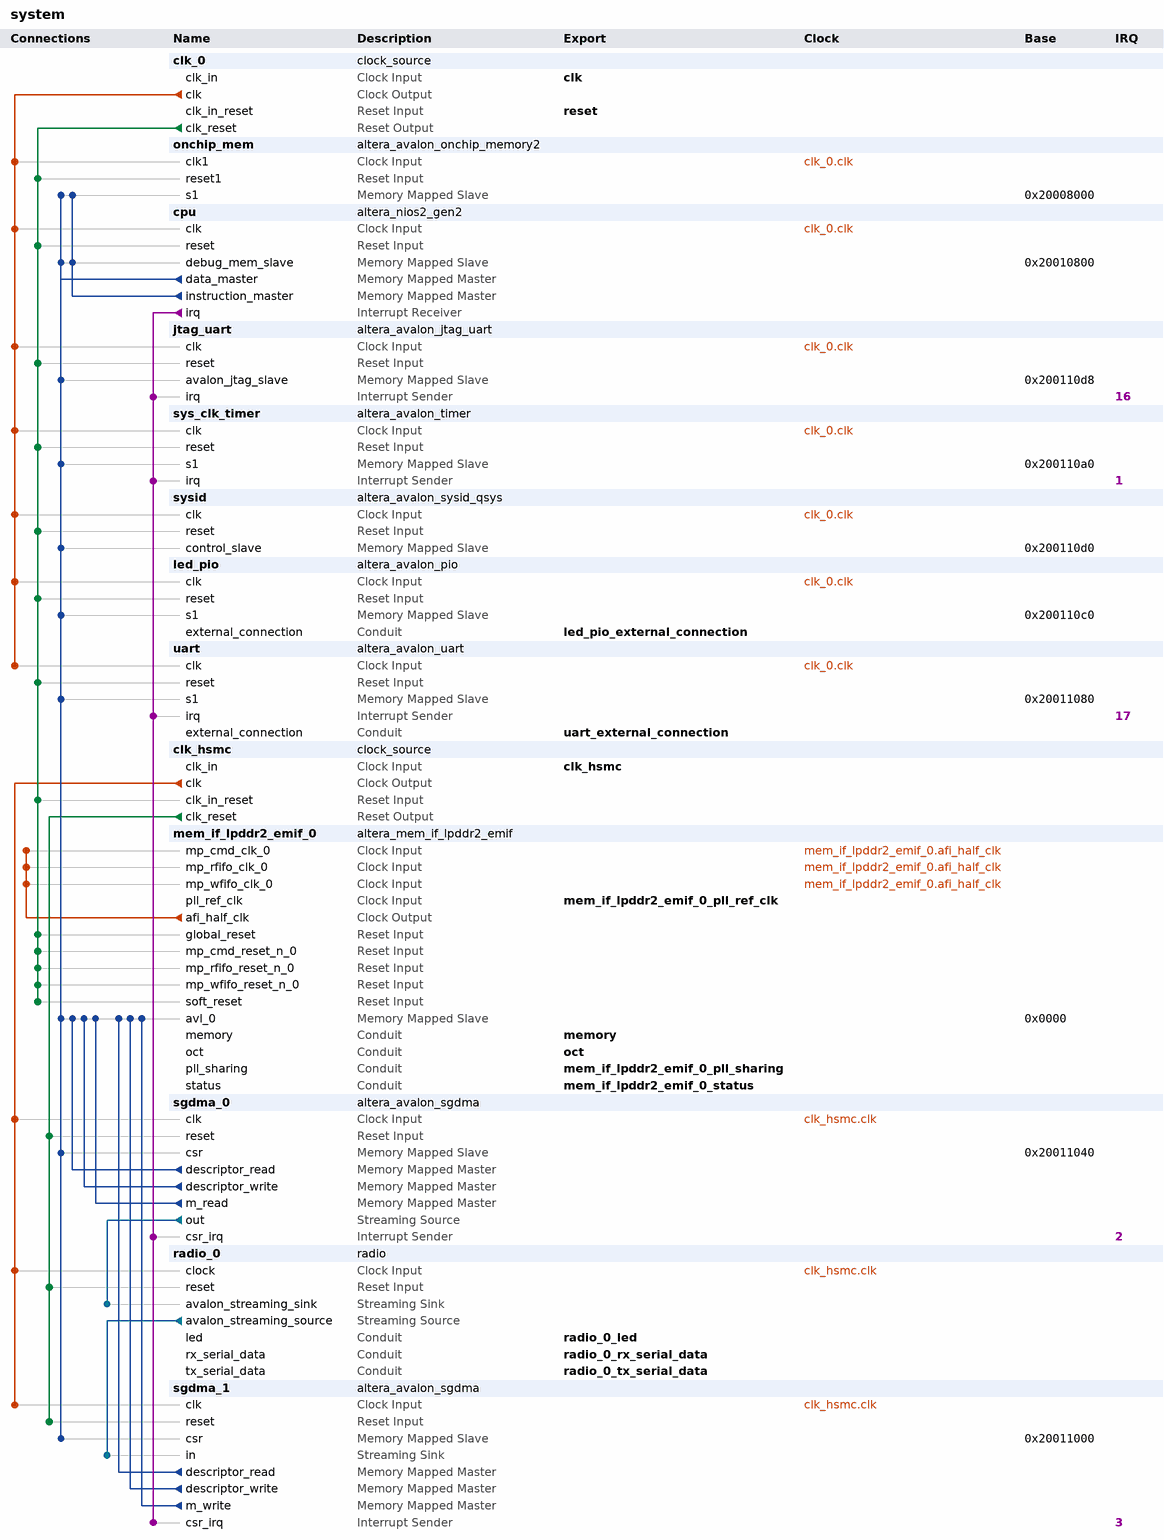
[diagram p0: system contents]
# Platform Designer (Qsys) system system, Cyclone V 5CGXFC5C6F27C7
# Parameters at their usual value, and those the tool derives, are not listed.
package require -exact qsys 15.1
create_system system
set_project_property DEVICE_FAMILY {Cyclone V}
set_project_property DEVICE 5CGXFC5C6F27C7

add_instance clk_0 clock_source 15.1
set_instance_parameter_value clk_0 clockFrequency 50000000

add_instance onchip_mem altera_avalon_onchip_memory2 15.1
set_instance_parameter_value onchip_mem dataWidth 32
set_instance_parameter_value onchip_mem dualPort false
set_instance_parameter_value onchip_mem initMemContent true
set_instance_parameter_value onchip_mem initializationFileName onchip_mem.hex
set_instance_parameter_value onchip_mem memorySize 32768

add_instance cpu altera_nios2_gen2 15.1
set_instance_parameter_value cpu dcache_size 0
set_instance_parameter_value cpu exceptionSlave onchip_mem.s1
set_instance_parameter_value cpu icache_size 2048
set_instance_parameter_value cpu impl Fast
set_instance_parameter_value cpu resetSlave onchip_mem.s1
set_instance_parameter_value cpu setting_branchpredictiontype Static

add_instance jtag_uart altera_avalon_jtag_uart 15.1
set_instance_parameter_value jtag_uart simInteractiveOptions NO_INTERACTIVE_WINDOWS

add_instance sys_clk_timer altera_avalon_timer 15.1
set_instance_parameter_value sys_clk_timer period 1
set_instance_parameter_value sys_clk_timer periodUnits MSEC

add_instance sysid altera_avalon_sysid_qsys 15.1
set_instance_parameter_value sysid id 0

add_instance led_pio altera_avalon_pio 15.1
set_instance_parameter_value led_pio direction Output
set_instance_parameter_value led_pio width 8

add_instance uart altera_avalon_uart 15.1
set_instance_parameter_value uart baud 115200
set_instance_parameter_value uart dataBits 8
set_instance_parameter_value uart fixedBaud true
set_instance_parameter_value uart parity NONE
set_instance_parameter_value uart stopBits 1

add_instance clk_hsmc clock_source 15.1
set_instance_parameter_value clk_hsmc clockFrequency 125000000

add_instance mem_if_lpddr2_emif_0 altera_mem_if_lpddr2_emif 15.1
set_instance_parameter_value mem_if_lpddr2_emif_0 ABSTRACT_REAL_COMPARE_TEST false
set_instance_parameter_value mem_if_lpddr2_emif_0 ABS_RAM_MEM_INIT_FILENAME meminit
set_instance_parameter_value mem_if_lpddr2_emif_0 ACV_PHY_CLK_ADD_FR_PHASE 0.0
set_instance_parameter_value mem_if_lpddr2_emif_0 AC_PACKAGE_DESKEW false
set_instance_parameter_value mem_if_lpddr2_emif_0 AC_ROM_USER_ADD_0 0_0000_0000_0000
set_instance_parameter_value mem_if_lpddr2_emif_0 AC_ROM_USER_ADD_1 0_0000_0000_1000
set_instance_parameter_value mem_if_lpddr2_emif_0 ADDR_ORDER 0
set_instance_parameter_value mem_if_lpddr2_emif_0 ADD_EFFICIENCY_MONITOR false
set_instance_parameter_value mem_if_lpddr2_emif_0 ADD_EXTERNAL_SEQ_DEBUG_NIOS false
set_instance_parameter_value mem_if_lpddr2_emif_0 ADVANCED_CK_PHASES false
set_instance_parameter_value mem_if_lpddr2_emif_0 ADVERTIZE_SEQUENCER_SW_BUILD_FILES false
set_instance_parameter_value mem_if_lpddr2_emif_0 AFI_DEBUG_INFO_WIDTH 32
set_instance_parameter_value mem_if_lpddr2_emif_0 ALTMEMPHY_COMPATIBLE_MODE false
set_instance_parameter_value mem_if_lpddr2_emif_0 AP_MODE false
set_instance_parameter_value mem_if_lpddr2_emif_0 AP_MODE_EN 0
set_instance_parameter_value mem_if_lpddr2_emif_0 AVL_DATA_WIDTH_PORT 32,32,32,32,32,32
set_instance_parameter_value mem_if_lpddr2_emif_0 AVL_MAX_SIZE 4
set_instance_parameter_value mem_if_lpddr2_emif_0 BYTE_ENABLE true
set_instance_parameter_value mem_if_lpddr2_emif_0 C2P_WRITE_CLOCK_ADD_PHASE 0.0
set_instance_parameter_value mem_if_lpddr2_emif_0 CALIBRATION_MODE Skip
set_instance_parameter_value mem_if_lpddr2_emif_0 CALIB_REG_WIDTH 8
set_instance_parameter_value mem_if_lpddr2_emif_0 CFG_DATA_REORDERING_TYPE INTER_BANK
set_instance_parameter_value mem_if_lpddr2_emif_0 CFG_REORDER_DATA true
set_instance_parameter_value mem_if_lpddr2_emif_0 CFG_TCCD_NS 2.5
set_instance_parameter_value mem_if_lpddr2_emif_0 COMMAND_PHASE 0.0
set_instance_parameter_value mem_if_lpddr2_emif_0 CONTROLLER_LATENCY 5
set_instance_parameter_value mem_if_lpddr2_emif_0 CORE_DEBUG_CONNECTION EXPORT
set_instance_parameter_value mem_if_lpddr2_emif_0 CPORT_TYPE_PORT Bidirectional,Bidirectional,Bidirectional,Bidirectional,Bidirectional,Bidirectional
set_instance_parameter_value mem_if_lpddr2_emif_0 CTL_AUTOPCH_EN false
set_instance_parameter_value mem_if_lpddr2_emif_0 CTL_CMD_QUEUE_DEPTH 8
set_instance_parameter_value mem_if_lpddr2_emif_0 CTL_CSR_CONNECTION INTERNAL_JTAG
set_instance_parameter_value mem_if_lpddr2_emif_0 CTL_CSR_ENABLED false
set_instance_parameter_value mem_if_lpddr2_emif_0 CTL_CSR_READ_ONLY 1
set_instance_parameter_value mem_if_lpddr2_emif_0 CTL_DEEP_POWERDN_EN false
set_instance_parameter_value mem_if_lpddr2_emif_0 CTL_DYNAMIC_BANK_ALLOCATION false
set_instance_parameter_value mem_if_lpddr2_emif_0 CTL_DYNAMIC_BANK_NUM 4
set_instance_parameter_value mem_if_lpddr2_emif_0 CTL_ECC_AUTO_CORRECTION_ENABLED false
set_instance_parameter_value mem_if_lpddr2_emif_0 CTL_ECC_ENABLED false
set_instance_parameter_value mem_if_lpddr2_emif_0 CTL_ENABLE_BURST_INTERRUPT false
set_instance_parameter_value mem_if_lpddr2_emif_0 CTL_ENABLE_BURST_TERMINATE false
set_instance_parameter_value mem_if_lpddr2_emif_0 CTL_HRB_ENABLED false
set_instance_parameter_value mem_if_lpddr2_emif_0 CTL_LOOK_AHEAD_DEPTH 4
set_instance_parameter_value mem_if_lpddr2_emif_0 CTL_SELF_REFRESH_EN false
set_instance_parameter_value mem_if_lpddr2_emif_0 CTL_USR_REFRESH_EN false
set_instance_parameter_value mem_if_lpddr2_emif_0 CTL_ZQCAL_EN false
set_instance_parameter_value mem_if_lpddr2_emif_0 CUT_NEW_FAMILY_TIMING true
set_instance_parameter_value mem_if_lpddr2_emif_0 DAT_DATA_WIDTH 32
set_instance_parameter_value mem_if_lpddr2_emif_0 DEBUG_MODE false
set_instance_parameter_value mem_if_lpddr2_emif_0 DEVICE_DEPTH 1
set_instance_parameter_value mem_if_lpddr2_emif_0 DISABLE_CHILD_MESSAGING false
set_instance_parameter_value mem_if_lpddr2_emif_0 DISCRETE_FLY_BY true
set_instance_parameter_value mem_if_lpddr2_emif_0 DLL_SHARING_MODE None
set_instance_parameter_value mem_if_lpddr2_emif_0 DQS_DQSN_MODE DIFFERENTIAL
set_instance_parameter_value mem_if_lpddr2_emif_0 DQ_INPUT_REG_USE_CLKN false
set_instance_parameter_value mem_if_lpddr2_emif_0 DUPLICATE_AC false
set_instance_parameter_value mem_if_lpddr2_emif_0 ED_EXPORT_SEQ_DEBUG false
set_instance_parameter_value mem_if_lpddr2_emif_0 ENABLE_ABS_RAM_MEM_INIT false
set_instance_parameter_value mem_if_lpddr2_emif_0 ENABLE_BONDING false
set_instance_parameter_value mem_if_lpddr2_emif_0 ENABLE_BURST_MERGE false
set_instance_parameter_value mem_if_lpddr2_emif_0 ENABLE_CTRL_AVALON_INTERFACE true
set_instance_parameter_value mem_if_lpddr2_emif_0 ENABLE_DELAY_CHAIN_WRITE false
set_instance_parameter_value mem_if_lpddr2_emif_0 ENABLE_EMIT_BFM_MASTER false
set_instance_parameter_value mem_if_lpddr2_emif_0 ENABLE_EXPORT_SEQ_DEBUG_BRIDGE false
set_instance_parameter_value mem_if_lpddr2_emif_0 ENABLE_EXTRA_REPORTING false
set_instance_parameter_value mem_if_lpddr2_emif_0 ENABLE_ISS_PROBES false
set_instance_parameter_value mem_if_lpddr2_emif_0 ENABLE_NON_DESTRUCTIVE_CALIB false
set_instance_parameter_value mem_if_lpddr2_emif_0 ENABLE_NON_DES_CAL false
set_instance_parameter_value mem_if_lpddr2_emif_0 ENABLE_NON_DES_CAL_TEST false
set_instance_parameter_value mem_if_lpddr2_emif_0 ENABLE_SEQUENCER_MARGINING_ON_BY_DEFAULT false
set_instance_parameter_value mem_if_lpddr2_emif_0 ENABLE_USER_ECC false
set_instance_parameter_value mem_if_lpddr2_emif_0 EXPORT_AFI_HALF_CLK true
set_instance_parameter_value mem_if_lpddr2_emif_0 FORCED_NON_LDC_ADDR_CMD_MEM_CK_INVERT false
set_instance_parameter_value mem_if_lpddr2_emif_0 FORCED_NUM_WRITE_FR_CYCLE_SHIFTS 0
set_instance_parameter_value mem_if_lpddr2_emif_0 FORCE_DQS_TRACKING AUTO
set_instance_parameter_value mem_if_lpddr2_emif_0 FORCE_MAX_LATENCY_COUNT_WIDTH 0
set_instance_parameter_value mem_if_lpddr2_emif_0 FORCE_SEQUENCER_TCL_DEBUG_MODE false
set_instance_parameter_value mem_if_lpddr2_emif_0 FORCE_SHADOW_REGS AUTO
set_instance_parameter_value mem_if_lpddr2_emif_0 HARD_EMIF true
set_instance_parameter_value mem_if_lpddr2_emif_0 HCX_COMPAT_MODE false
set_instance_parameter_value mem_if_lpddr2_emif_0 HHP_HPS false
set_instance_parameter_value mem_if_lpddr2_emif_0 HHP_HPS_SIMULATION false
set_instance_parameter_value mem_if_lpddr2_emif_0 HHP_HPS_VERIFICATION false
set_instance_parameter_value mem_if_lpddr2_emif_0 HPS_PROTOCOL DEFAULT
set_instance_parameter_value mem_if_lpddr2_emif_0 INCLUDE_BOARD_DELAY_MODEL false
set_instance_parameter_value mem_if_lpddr2_emif_0 INCLUDE_MULTIRANK_BOARD_DELAY_MODEL false
set_instance_parameter_value mem_if_lpddr2_emif_0 IS_ES_DEVICE false
set_instance_parameter_value mem_if_lpddr2_emif_0 LOCAL_ID_WIDTH 8
set_instance_parameter_value mem_if_lpddr2_emif_0 MARGIN_VARIATION_TEST false
set_instance_parameter_value mem_if_lpddr2_emif_0 MAX_PENDING_RD_CMD 32
set_instance_parameter_value mem_if_lpddr2_emif_0 MAX_PENDING_WR_CMD 16
set_instance_parameter_value mem_if_lpddr2_emif_0 MEM_ATCL 0
set_instance_parameter_value mem_if_lpddr2_emif_0 MEM_AUTO_LEVELING_MODE true
set_instance_parameter_value mem_if_lpddr2_emif_0 MEM_BANKADDR_WIDTH 3
set_instance_parameter_value mem_if_lpddr2_emif_0 MEM_BL 8
set_instance_parameter_value mem_if_lpddr2_emif_0 MEM_BT Sequential
set_instance_parameter_value mem_if_lpddr2_emif_0 MEM_CK_PHASE 0.0
set_instance_parameter_value mem_if_lpddr2_emif_0 MEM_CK_WIDTH 1
set_instance_parameter_value mem_if_lpddr2_emif_0 MEM_CLK_EN_WIDTH 1
set_instance_parameter_value mem_if_lpddr2_emif_0 MEM_CLK_FREQ 330.0
set_instance_parameter_value mem_if_lpddr2_emif_0 MEM_CLK_FREQ_MAX 400.0
set_instance_parameter_value mem_if_lpddr2_emif_0 MEM_COL_ADDR_WIDTH 10
set_instance_parameter_value mem_if_lpddr2_emif_0 MEM_CS_WIDTH 1
set_instance_parameter_value mem_if_lpddr2_emif_0 MEM_DEVICE MISSING_MODEL
set_instance_parameter_value mem_if_lpddr2_emif_0 MEM_DLL_EN true
set_instance_parameter_value mem_if_lpddr2_emif_0 MEM_DQ_PER_DQS 8
set_instance_parameter_value mem_if_lpddr2_emif_0 MEM_DQ_WIDTH 32
set_instance_parameter_value mem_if_lpddr2_emif_0 MEM_DRV_STR 40
set_instance_parameter_value mem_if_lpddr2_emif_0 MEM_FORMAT DISCRETE
set_instance_parameter_value mem_if_lpddr2_emif_0 MEM_GUARANTEED_WRITE_INIT false
set_instance_parameter_value mem_if_lpddr2_emif_0 MEM_IF_BOARD_BASE_DELAY 10
set_instance_parameter_value mem_if_lpddr2_emif_0 MEM_IF_DM_PINS_EN true
set_instance_parameter_value mem_if_lpddr2_emif_0 MEM_IF_DQSN_EN true
set_instance_parameter_value mem_if_lpddr2_emif_0 MEM_IF_SIM_VALID_WINDOW 0
set_instance_parameter_value mem_if_lpddr2_emif_0 MEM_INIT_EN false
set_instance_parameter_value mem_if_lpddr2_emif_0 MEM_MIRROR_ADDRESSING 0
set_instance_parameter_value mem_if_lpddr2_emif_0 MEM_NUMBER_OF_DIMMS 1
set_instance_parameter_value mem_if_lpddr2_emif_0 MEM_NUMBER_OF_RANKS_PER_DEVICE 1
set_instance_parameter_value mem_if_lpddr2_emif_0 MEM_NUMBER_OF_RANKS_PER_DIMM 1
set_instance_parameter_value mem_if_lpddr2_emif_0 MEM_RANK_MULTIPLICATION_FACTOR 1
set_instance_parameter_value mem_if_lpddr2_emif_0 MEM_ROW_ADDR_WIDTH 14
set_instance_parameter_value mem_if_lpddr2_emif_0 MEM_TCL 7
set_instance_parameter_value mem_if_lpddr2_emif_0 MEM_TFAW_NS 37.5
set_instance_parameter_value mem_if_lpddr2_emif_0 MEM_TINIT_US 499
set_instance_parameter_value mem_if_lpddr2_emif_0 MEM_TMRD_CK 3
set_instance_parameter_value mem_if_lpddr2_emif_0 MEM_TRAS_NS 40.0
set_instance_parameter_value mem_if_lpddr2_emif_0 MEM_TRCD_NS 15.0
set_instance_parameter_value mem_if_lpddr2_emif_0 MEM_TREFI_US 7.0
set_instance_parameter_value mem_if_lpddr2_emif_0 MEM_TRFC_NS 75.0
set_instance_parameter_value mem_if_lpddr2_emif_0 MEM_TRP_NS 15.0
set_instance_parameter_value mem_if_lpddr2_emif_0 MEM_TRRD_NS 7.5
set_instance_parameter_value mem_if_lpddr2_emif_0 MEM_TRTP_NS 7.5
set_instance_parameter_value mem_if_lpddr2_emif_0 MEM_TWR_NS 15.0
set_instance_parameter_value mem_if_lpddr2_emif_0 MEM_TWTR 2
set_instance_parameter_value mem_if_lpddr2_emif_0 MEM_USER_LEVELING_MODE Leveling
set_instance_parameter_value mem_if_lpddr2_emif_0 MEM_VENDOR Micron
set_instance_parameter_value mem_if_lpddr2_emif_0 MEM_VERBOSE true
set_instance_parameter_value mem_if_lpddr2_emif_0 MRS_MIRROR_PING_PONG_ATSO false
set_instance_parameter_value mem_if_lpddr2_emif_0 MULTICAST_EN false
set_instance_parameter_value mem_if_lpddr2_emif_0 NEXTGEN true
set_instance_parameter_value mem_if_lpddr2_emif_0 NIOS_ROM_DATA_WIDTH 32
set_instance_parameter_value mem_if_lpddr2_emif_0 NUM_DLL_SHARING_INTERFACES 1
set_instance_parameter_value mem_if_lpddr2_emif_0 NUM_EXTRA_REPORT_PATH 10
set_instance_parameter_value mem_if_lpddr2_emif_0 NUM_OCT_SHARING_INTERFACES 1
set_instance_parameter_value mem_if_lpddr2_emif_0 NUM_OF_PORTS 1
set_instance_parameter_value mem_if_lpddr2_emif_0 NUM_PLL_SHARING_INTERFACES 1
set_instance_parameter_value mem_if_lpddr2_emif_0 OCT_SHARING_MODE None
set_instance_parameter_value mem_if_lpddr2_emif_0 P2C_READ_CLOCK_ADD_PHASE 0.0
set_instance_parameter_value mem_if_lpddr2_emif_0 PACKAGE_DESKEW false
set_instance_parameter_value mem_if_lpddr2_emif_0 PARSE_FRIENDLY_DEVICE_FAMILY_PARAM_VALID false
set_instance_parameter_value mem_if_lpddr2_emif_0 PHY_CSR_CONNECTION INTERNAL_JTAG
set_instance_parameter_value mem_if_lpddr2_emif_0 PHY_CSR_ENABLED false
set_instance_parameter_value mem_if_lpddr2_emif_0 PHY_ONLY false
set_instance_parameter_value mem_if_lpddr2_emif_0 PINGPONGPHY_EN false
set_instance_parameter_value mem_if_lpddr2_emif_0 PLL_ADDR_CMD_CLK_DIV_PARAM 0
set_instance_parameter_value mem_if_lpddr2_emif_0 PLL_ADDR_CMD_CLK_FREQ_PARAM 0.0
set_instance_parameter_value mem_if_lpddr2_emif_0 PLL_ADDR_CMD_CLK_MULT_PARAM 0
set_instance_parameter_value mem_if_lpddr2_emif_0 PLL_ADDR_CMD_CLK_PHASE_PS_PARAM 0
set_instance_parameter_value mem_if_lpddr2_emif_0 PLL_AFI_CLK_DIV_PARAM 0
set_instance_parameter_value mem_if_lpddr2_emif_0 PLL_AFI_CLK_FREQ_PARAM 0.0
set_instance_parameter_value mem_if_lpddr2_emif_0 PLL_AFI_CLK_MULT_PARAM 0
set_instance_parameter_value mem_if_lpddr2_emif_0 PLL_AFI_CLK_PHASE_PS_PARAM 0
set_instance_parameter_value mem_if_lpddr2_emif_0 PLL_AFI_HALF_CLK_DIV_PARAM 0
set_instance_parameter_value mem_if_lpddr2_emif_0 PLL_AFI_HALF_CLK_FREQ_PARAM 0.0
set_instance_parameter_value mem_if_lpddr2_emif_0 PLL_AFI_HALF_CLK_MULT_PARAM 0
set_instance_parameter_value mem_if_lpddr2_emif_0 PLL_AFI_HALF_CLK_PHASE_PS_PARAM 0
set_instance_parameter_value mem_if_lpddr2_emif_0 PLL_AFI_PHY_CLK_DIV_PARAM 0
set_instance_parameter_value mem_if_lpddr2_emif_0 PLL_AFI_PHY_CLK_FREQ_PARAM 0.0
set_instance_parameter_value mem_if_lpddr2_emif_0 PLL_AFI_PHY_CLK_MULT_PARAM 0
set_instance_parameter_value mem_if_lpddr2_emif_0 PLL_AFI_PHY_CLK_PHASE_PS_PARAM 0
set_instance_parameter_value mem_if_lpddr2_emif_0 PLL_C2P_WRITE_CLK_DIV_PARAM 0
set_instance_parameter_value mem_if_lpddr2_emif_0 PLL_C2P_WRITE_CLK_FREQ_PARAM 0.0
set_instance_parameter_value mem_if_lpddr2_emif_0 PLL_C2P_WRITE_CLK_MULT_PARAM 0
set_instance_parameter_value mem_if_lpddr2_emif_0 PLL_C2P_WRITE_CLK_PHASE_PS_PARAM 0
set_instance_parameter_value mem_if_lpddr2_emif_0 PLL_CLK_PARAM_VALID false
set_instance_parameter_value mem_if_lpddr2_emif_0 PLL_CONFIG_CLK_DIV_PARAM 0
set_instance_parameter_value mem_if_lpddr2_emif_0 PLL_CONFIG_CLK_FREQ_PARAM 0.0
set_instance_parameter_value mem_if_lpddr2_emif_0 PLL_CONFIG_CLK_MULT_PARAM 0
set_instance_parameter_value mem_if_lpddr2_emif_0 PLL_CONFIG_CLK_PHASE_PS_PARAM 0
set_instance_parameter_value mem_if_lpddr2_emif_0 PLL_DR_CLK_DIV_PARAM 0
set_instance_parameter_value mem_if_lpddr2_emif_0 PLL_DR_CLK_FREQ_PARAM 0.0
set_instance_parameter_value mem_if_lpddr2_emif_0 PLL_DR_CLK_MULT_PARAM 0
set_instance_parameter_value mem_if_lpddr2_emif_0 PLL_DR_CLK_PHASE_PS_PARAM 0
set_instance_parameter_value mem_if_lpddr2_emif_0 PLL_HR_CLK_DIV_PARAM 0
set_instance_parameter_value mem_if_lpddr2_emif_0 PLL_HR_CLK_FREQ_PARAM 0.0
set_instance_parameter_value mem_if_lpddr2_emif_0 PLL_HR_CLK_MULT_PARAM 0
set_instance_parameter_value mem_if_lpddr2_emif_0 PLL_HR_CLK_PHASE_PS_PARAM 0
set_instance_parameter_value mem_if_lpddr2_emif_0 PLL_LOCATION Top_Bottom
set_instance_parameter_value mem_if_lpddr2_emif_0 PLL_MEM_CLK_DIV_PARAM 0
set_instance_parameter_value mem_if_lpddr2_emif_0 PLL_MEM_CLK_FREQ_PARAM 0.0
set_instance_parameter_value mem_if_lpddr2_emif_0 PLL_MEM_CLK_MULT_PARAM 0
set_instance_parameter_value mem_if_lpddr2_emif_0 PLL_MEM_CLK_PHASE_PS_PARAM 0
set_instance_parameter_value mem_if_lpddr2_emif_0 PLL_NIOS_CLK_DIV_PARAM 0
set_instance_parameter_value mem_if_lpddr2_emif_0 PLL_NIOS_CLK_FREQ_PARAM 0.0
set_instance_parameter_value mem_if_lpddr2_emif_0 PLL_NIOS_CLK_MULT_PARAM 0
set_instance_parameter_value mem_if_lpddr2_emif_0 PLL_NIOS_CLK_PHASE_PS_PARAM 0
set_instance_parameter_value mem_if_lpddr2_emif_0 PLL_P2C_READ_CLK_DIV_PARAM 0
set_instance_parameter_value mem_if_lpddr2_emif_0 PLL_P2C_READ_CLK_FREQ_PARAM 0.0
set_instance_parameter_value mem_if_lpddr2_emif_0 PLL_P2C_READ_CLK_MULT_PARAM 0
set_instance_parameter_value mem_if_lpddr2_emif_0 PLL_P2C_READ_CLK_PHASE_PS_PARAM 0
set_instance_parameter_value mem_if_lpddr2_emif_0 PLL_SHARING_MODE None
set_instance_parameter_value mem_if_lpddr2_emif_0 PLL_WRITE_CLK_DIV_PARAM 0
set_instance_parameter_value mem_if_lpddr2_emif_0 PLL_WRITE_CLK_FREQ_PARAM 0.0
set_instance_parameter_value mem_if_lpddr2_emif_0 PLL_WRITE_CLK_MULT_PARAM 0
set_instance_parameter_value mem_if_lpddr2_emif_0 PLL_WRITE_CLK_PHASE_PS_PARAM 0
set_instance_parameter_value mem_if_lpddr2_emif_0 POWER_OF_TWO_BUS false
set_instance_parameter_value mem_if_lpddr2_emif_0 PRIORITY_PORT 1,1,1,1,1,1
set_instance_parameter_value mem_if_lpddr2_emif_0 RATE Full
set_instance_parameter_value mem_if_lpddr2_emif_0 READ_DQ_DQS_CLOCK_SOURCE INVERTED_DQS_BUS
set_instance_parameter_value mem_if_lpddr2_emif_0 READ_FIFO_SIZE 8
set_instance_parameter_value mem_if_lpddr2_emif_0 REFRESH_BURST_VALIDATION false
set_instance_parameter_value mem_if_lpddr2_emif_0 REFRESH_INTERVAL 15000
set_instance_parameter_value mem_if_lpddr2_emif_0 REF_CLK_FREQ 50.0
set_instance_parameter_value mem_if_lpddr2_emif_0 REF_CLK_FREQ_MAX_PARAM 0.0
set_instance_parameter_value mem_if_lpddr2_emif_0 REF_CLK_FREQ_MIN_PARAM 0.0
set_instance_parameter_value mem_if_lpddr2_emif_0 REF_CLK_FREQ_PARAM_VALID false
set_instance_parameter_value mem_if_lpddr2_emif_0 SEQUENCER_TYPE NIOS
set_instance_parameter_value mem_if_lpddr2_emif_0 SEQ_MODE 0
set_instance_parameter_value mem_if_lpddr2_emif_0 SKIP_MEM_INIT true
set_instance_parameter_value mem_if_lpddr2_emif_0 SOPC_COMPAT_RESET false
set_instance_parameter_value mem_if_lpddr2_emif_0 SPEED_GRADE 7
set_instance_parameter_value mem_if_lpddr2_emif_0 STARVE_LIMIT 10
set_instance_parameter_value mem_if_lpddr2_emif_0 TIMING_BOARD_AC_EYE_REDUCTION_H 0.0
set_instance_parameter_value mem_if_lpddr2_emif_0 TIMING_BOARD_AC_EYE_REDUCTION_SU 0.0
set_instance_parameter_value mem_if_lpddr2_emif_0 TIMING_BOARD_AC_SKEW 0.02
set_instance_parameter_value mem_if_lpddr2_emif_0 TIMING_BOARD_AC_SLEW_RATE 1.0
set_instance_parameter_value mem_if_lpddr2_emif_0 TIMING_BOARD_AC_TO_CK_SKEW 0.0
set_instance_parameter_value mem_if_lpddr2_emif_0 TIMING_BOARD_CK_CKN_SLEW_RATE 2.0
set_instance_parameter_value mem_if_lpddr2_emif_0 TIMING_BOARD_DELTA_DQS_ARRIVAL_TIME 0.0
set_instance_parameter_value mem_if_lpddr2_emif_0 TIMING_BOARD_DELTA_READ_DQS_ARRIVAL_TIME 0.0
set_instance_parameter_value mem_if_lpddr2_emif_0 TIMING_BOARD_DERATE_METHOD AUTO
set_instance_parameter_value mem_if_lpddr2_emif_0 TIMING_BOARD_DQS_DQSN_SLEW_RATE 2.0
set_instance_parameter_value mem_if_lpddr2_emif_0 TIMING_BOARD_DQ_EYE_REDUCTION 0.0
set_instance_parameter_value mem_if_lpddr2_emif_0 TIMING_BOARD_DQ_SLEW_RATE 1.0
set_instance_parameter_value mem_if_lpddr2_emif_0 TIMING_BOARD_DQ_TO_DQS_SKEW 0.0
set_instance_parameter_value mem_if_lpddr2_emif_0 TIMING_BOARD_ISI_METHOD AUTO
set_instance_parameter_value mem_if_lpddr2_emif_0 TIMING_BOARD_MAX_CK_DELAY 0.6
set_instance_parameter_value mem_if_lpddr2_emif_0 TIMING_BOARD_MAX_DQS_DELAY 0.6
set_instance_parameter_value mem_if_lpddr2_emif_0 TIMING_BOARD_READ_DQ_EYE_REDUCTION 0.0
set_instance_parameter_value mem_if_lpddr2_emif_0 TIMING_BOARD_SKEW_BETWEEN_DIMMS 0.05
set_instance_parameter_value mem_if_lpddr2_emif_0 TIMING_BOARD_SKEW_BETWEEN_DQS 0.02
set_instance_parameter_value mem_if_lpddr2_emif_0 TIMING_BOARD_SKEW_CKDQS_DIMM_MAX 0.01
set_instance_parameter_value mem_if_lpddr2_emif_0 TIMING_BOARD_SKEW_CKDQS_DIMM_MIN -0.01
set_instance_parameter_value mem_if_lpddr2_emif_0 TIMING_BOARD_SKEW_WITHIN_DQS 0.02
set_instance_parameter_value mem_if_lpddr2_emif_0 TIMING_BOARD_TDH 0.0
set_instance_parameter_value mem_if_lpddr2_emif_0 TIMING_BOARD_TDS 0.0
set_instance_parameter_value mem_if_lpddr2_emif_0 TIMING_BOARD_TIH 0.0
set_instance_parameter_value mem_if_lpddr2_emif_0 TIMING_BOARD_TIS 0.0
set_instance_parameter_value mem_if_lpddr2_emif_0 TIMING_TDH 125
set_instance_parameter_value mem_if_lpddr2_emif_0 TIMING_TDQSCK 2500
set_instance_parameter_value mem_if_lpddr2_emif_0 TIMING_TDQSCKDL 1200
set_instance_parameter_value mem_if_lpddr2_emif_0 TIMING_TDQSCKDM 900
set_instance_parameter_value mem_if_lpddr2_emif_0 TIMING_TDQSCKDS 450
set_instance_parameter_value mem_if_lpddr2_emif_0 TIMING_TDQSH 0.35
set_instance_parameter_value mem_if_lpddr2_emif_0 TIMING_TDQSQ 120
set_instance_parameter_value mem_if_lpddr2_emif_0 TIMING_TDQSS 0.25
set_instance_parameter_value mem_if_lpddr2_emif_0 TIMING_TDS 50
set_instance_parameter_value mem_if_lpddr2_emif_0 TIMING_TDSH 0.2
set_instance_parameter_value mem_if_lpddr2_emif_0 TIMING_TDSS 0.2
set_instance_parameter_value mem_if_lpddr2_emif_0 TIMING_TIH 250
set_instance_parameter_value mem_if_lpddr2_emif_0 TIMING_TIS 175
set_instance_parameter_value mem_if_lpddr2_emif_0 TIMING_TQHS 300
set_instance_parameter_value mem_if_lpddr2_emif_0 TRACKING_ERROR_TEST false
set_instance_parameter_value mem_if_lpddr2_emif_0 TRACKING_WATCH_TEST false
set_instance_parameter_value mem_if_lpddr2_emif_0 TREFI 35100
set_instance_parameter_value mem_if_lpddr2_emif_0 TRFC 350
set_instance_parameter_value mem_if_lpddr2_emif_0 USER_DEBUG_LEVEL 1
set_instance_parameter_value mem_if_lpddr2_emif_0 USE_AXI_ADAPTOR false
set_instance_parameter_value mem_if_lpddr2_emif_0 USE_FAKE_PHY false
set_instance_parameter_value mem_if_lpddr2_emif_0 USE_MEM_CLK_FREQ false
set_instance_parameter_value mem_if_lpddr2_emif_0 USE_MM_ADAPTOR true
set_instance_parameter_value mem_if_lpddr2_emif_0 USE_SEQUENCER_BFM false
set_instance_parameter_value mem_if_lpddr2_emif_0 WEIGHT_PORT 0,0,0,0,0,0
set_instance_parameter_value mem_if_lpddr2_emif_0 WRBUFFER_ADDR_WIDTH 6

add_instance sgdma_0 altera_avalon_sgdma 15.1
set_instance_parameter_value sgdma_0 enableBurstTransfers false
set_instance_parameter_value sgdma_0 enableUnalignedTransfers false
set_instance_parameter_value sgdma_0 readBlockDataWidth 8
set_instance_parameter_value sgdma_0 readBurstcountWidth 12
set_instance_parameter_value sgdma_0 sinkErrorWidth 0
set_instance_parameter_value sgdma_0 sourceErrorWidth 0
set_instance_parameter_value sgdma_0 transferMode MEMORY_TO_STREAM
set_instance_parameter_value sgdma_0 writeBurstcountWidth 4

add_instance radio_0 radio 1.0

add_instance sgdma_1 altera_avalon_sgdma 15.1
set_instance_parameter_value sgdma_1 enableBurstTransfers false
set_instance_parameter_value sgdma_1 enableUnalignedTransfers false
set_instance_parameter_value sgdma_1 readBlockDataWidth 8
set_instance_parameter_value sgdma_1 sinkErrorWidth 0
set_instance_parameter_value sgdma_1 sourceErrorWidth 0
set_instance_parameter_value sgdma_1 transferMode STREAM_TO_MEMORY
set_instance_parameter_value sgdma_1 writeBurstcountWidth 4

# connections
add_connection clk_0.clk cpu.clk clock
add_connection clk_0.clk jtag_uart.clk clock
add_connection clk_0.clk led_pio.clk clock
add_connection clk_0.clk onchip_mem.clk1 clock
add_connection clk_0.clk sys_clk_timer.clk clock
add_connection clk_0.clk sysid.clk clock
add_connection clk_0.clk uart.clk clock
add_connection clk_hsmc.clk radio_0.clock clock
add_connection clk_hsmc.clk sgdma_0.clk clock
add_connection clk_hsmc.clk sgdma_1.clk clock
add_connection mem_if_lpddr2_emif_0.afi_half_clk mem_if_lpddr2_emif_0.mp_cmd_clk_0 clock
add_connection mem_if_lpddr2_emif_0.afi_half_clk mem_if_lpddr2_emif_0.mp_rfifo_clk_0 clock
add_connection mem_if_lpddr2_emif_0.afi_half_clk mem_if_lpddr2_emif_0.mp_wfifo_clk_0 clock
add_connection clk_0.clk_reset clk_hsmc.clk_in_reset reset
add_connection clk_0.clk_reset cpu.reset reset
add_connection clk_0.clk_reset jtag_uart.reset reset
add_connection clk_0.clk_reset led_pio.reset reset
add_connection clk_0.clk_reset mem_if_lpddr2_emif_0.global_reset reset
add_connection clk_0.clk_reset mem_if_lpddr2_emif_0.mp_cmd_reset_n_0 reset
add_connection clk_0.clk_reset mem_if_lpddr2_emif_0.mp_rfifo_reset_n_0 reset
add_connection clk_0.clk_reset mem_if_lpddr2_emif_0.mp_wfifo_reset_n_0 reset
add_connection clk_0.clk_reset mem_if_lpddr2_emif_0.soft_reset reset
add_connection clk_0.clk_reset onchip_mem.reset1 reset
add_connection clk_0.clk_reset sys_clk_timer.reset reset
add_connection clk_0.clk_reset sysid.reset reset
add_connection clk_0.clk_reset uart.reset reset
add_connection clk_hsmc.clk_reset radio_0.reset reset
add_connection clk_hsmc.clk_reset sgdma_0.reset reset
add_connection clk_hsmc.clk_reset sgdma_1.reset reset
add_connection cpu.data_master cpu.debug_mem_slave avalon
set_connection_parameter_value cpu.data_master/cpu.debug_mem_slave baseAddress 0x20010800
add_connection cpu.data_master jtag_uart.avalon_jtag_slave avalon
set_connection_parameter_value cpu.data_master/jtag_uart.avalon_jtag_slave baseAddress 0x200110d8
add_connection cpu.data_master led_pio.s1 avalon
set_connection_parameter_value cpu.data_master/led_pio.s1 baseAddress 0x200110c0
add_connection cpu.data_master mem_if_lpddr2_emif_0.avl_0 avalon
set_connection_parameter_value cpu.data_master/mem_if_lpddr2_emif_0.avl_0 baseAddress 0x0000
add_connection cpu.data_master onchip_mem.s1 avalon
set_connection_parameter_value cpu.data_master/onchip_mem.s1 baseAddress 0x20008000
add_connection cpu.data_master sgdma_0.csr avalon
set_connection_parameter_value cpu.data_master/sgdma_0.csr baseAddress 0x20011040
add_connection cpu.data_master sgdma_1.csr avalon
set_connection_parameter_value cpu.data_master/sgdma_1.csr baseAddress 0x20011000
add_connection cpu.data_master sys_clk_timer.s1 avalon
set_connection_parameter_value cpu.data_master/sys_clk_timer.s1 baseAddress 0x200110a0
add_connection cpu.data_master sysid.control_slave avalon
set_connection_parameter_value cpu.data_master/sysid.control_slave baseAddress 0x200110d0
add_connection cpu.data_master uart.s1 avalon
set_connection_parameter_value cpu.data_master/uart.s1 baseAddress 0x20011080
add_connection cpu.instruction_master cpu.debug_mem_slave avalon
set_connection_parameter_value cpu.instruction_master/cpu.debug_mem_slave baseAddress 0x20010800
add_connection cpu.instruction_master onchip_mem.s1 avalon
set_connection_parameter_value cpu.instruction_master/onchip_mem.s1 baseAddress 0x20008000
add_connection sgdma_0.descriptor_read mem_if_lpddr2_emif_0.avl_0 avalon
set_connection_parameter_value sgdma_0.descriptor_read/mem_if_lpddr2_emif_0.avl_0 baseAddress 0x0000
add_connection sgdma_0.descriptor_write mem_if_lpddr2_emif_0.avl_0 avalon
set_connection_parameter_value sgdma_0.descriptor_write/mem_if_lpddr2_emif_0.avl_0 baseAddress 0x0000
add_connection sgdma_0.m_read mem_if_lpddr2_emif_0.avl_0 avalon
set_connection_parameter_value sgdma_0.m_read/mem_if_lpddr2_emif_0.avl_0 baseAddress 0x0000
add_connection sgdma_1.descriptor_read mem_if_lpddr2_emif_0.avl_0 avalon
set_connection_parameter_value sgdma_1.descriptor_read/mem_if_lpddr2_emif_0.avl_0 baseAddress 0x0000
add_connection sgdma_1.descriptor_write mem_if_lpddr2_emif_0.avl_0 avalon
set_connection_parameter_value sgdma_1.descriptor_write/mem_if_lpddr2_emif_0.avl_0 baseAddress 0x0000
add_connection sgdma_1.m_write mem_if_lpddr2_emif_0.avl_0 avalon
set_connection_parameter_value sgdma_1.m_write/mem_if_lpddr2_emif_0.avl_0 baseAddress 0x0000
add_connection radio_0.avalon_streaming_source sgdma_1.in avalon_streaming
add_connection sgdma_0.out radio_0.avalon_streaming_sink avalon_streaming
add_connection cpu.irq jtag_uart.irq interrupt
set_connection_parameter_value cpu.irq/jtag_uart.irq irqNumber 16
add_connection cpu.irq sgdma_0.csr_irq interrupt
set_connection_parameter_value cpu.irq/sgdma_0.csr_irq irqNumber 2
add_connection cpu.irq sgdma_1.csr_irq interrupt
set_connection_parameter_value cpu.irq/sgdma_1.csr_irq irqNumber 3
add_connection cpu.irq sys_clk_timer.irq interrupt
set_connection_parameter_value cpu.irq/sys_clk_timer.irq irqNumber 1
add_connection cpu.irq uart.irq interrupt
set_connection_parameter_value cpu.irq/uart.irq irqNumber 17

# exported interfaces
add_interface clk clock sink
set_interface_property clk EXPORT_OF clk_0.clk_in
add_interface clk_hsmc clock sink
set_interface_property clk_hsmc EXPORT_OF clk_hsmc.clk_in
add_interface led_pio_external_connection conduit end
set_interface_property led_pio_external_connection EXPORT_OF led_pio.external_connection
add_interface mem_if_lpddr2_emif_0_pll_ref_clk clock sink
set_interface_property mem_if_lpddr2_emif_0_pll_ref_clk EXPORT_OF mem_if_lpddr2_emif_0.pll_ref_clk
add_interface mem_if_lpddr2_emif_0_pll_sharing conduit end
set_interface_property mem_if_lpddr2_emif_0_pll_sharing EXPORT_OF mem_if_lpddr2_emif_0.pll_sharing
add_interface mem_if_lpddr2_emif_0_status conduit end
set_interface_property mem_if_lpddr2_emif_0_status EXPORT_OF mem_if_lpddr2_emif_0.status
add_interface memory conduit end
set_interface_property memory EXPORT_OF mem_if_lpddr2_emif_0.memory
add_interface oct conduit end
set_interface_property oct EXPORT_OF mem_if_lpddr2_emif_0.oct
add_interface radio_0_led conduit end
set_interface_property radio_0_led EXPORT_OF radio_0.led
add_interface radio_0_rx_serial_data conduit end
set_interface_property radio_0_rx_serial_data EXPORT_OF radio_0.rx_serial_data
add_interface radio_0_tx_serial_data conduit end
set_interface_property radio_0_tx_serial_data EXPORT_OF radio_0.tx_serial_data
add_interface reset reset sink
set_interface_property reset EXPORT_OF clk_0.clk_in_reset
add_interface uart_external_connection conduit end
set_interface_property uart_external_connection EXPORT_OF uart.external_connection

set_interconnect_requirement {$system} qsys_mm.clockCrossingAdapter HANDSHAKE
set_interconnect_requirement {$system} qsys_mm.enableEccProtection FALSE
set_interconnect_requirement {$system} qsys_mm.insertDefaultSlave FALSE
set_interconnect_requirement {$system} qsys_mm.maxAdditionalLatency 1

save_system system.qsys
